# EasyEDA Pro project uChameleon.eprj, schematic Schematic1

## Sheets
1 Pico: Board Name: Board1; Create Date: 2026-08-13; Page Name: Pico; Project Name: uChameleon; Schematic Name: Schematic1; Update Date: 2026-08-26; Company: EasyEDA.com; Page Size: A4; Version: V1.0
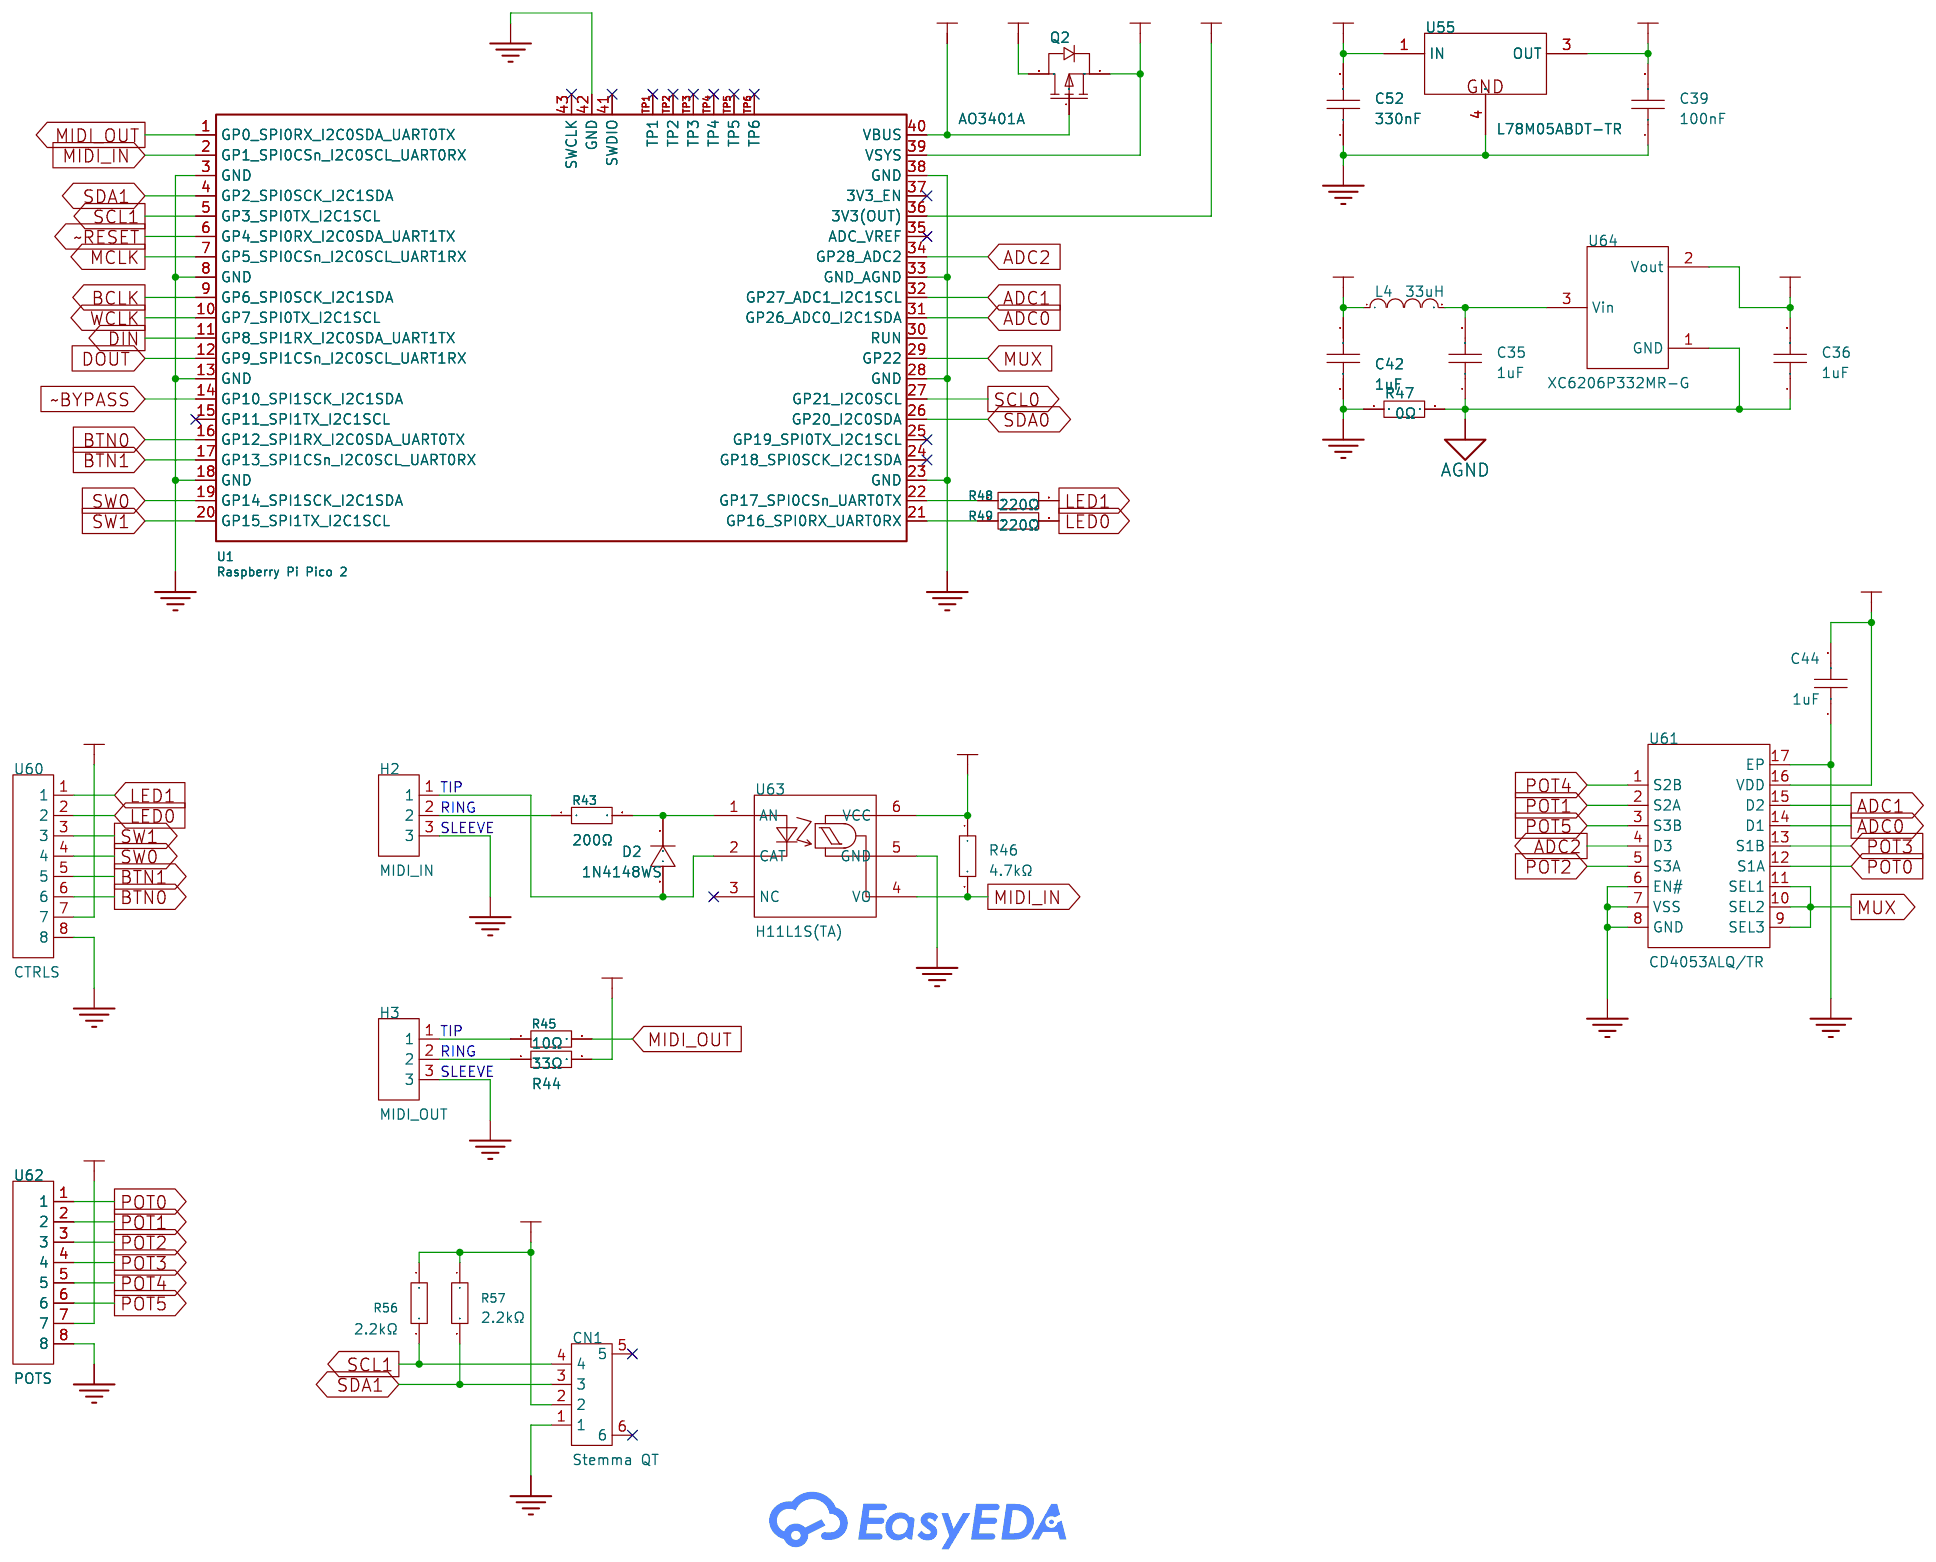
[diagram p0: Pico]
2 Codec: Page Name: Codec
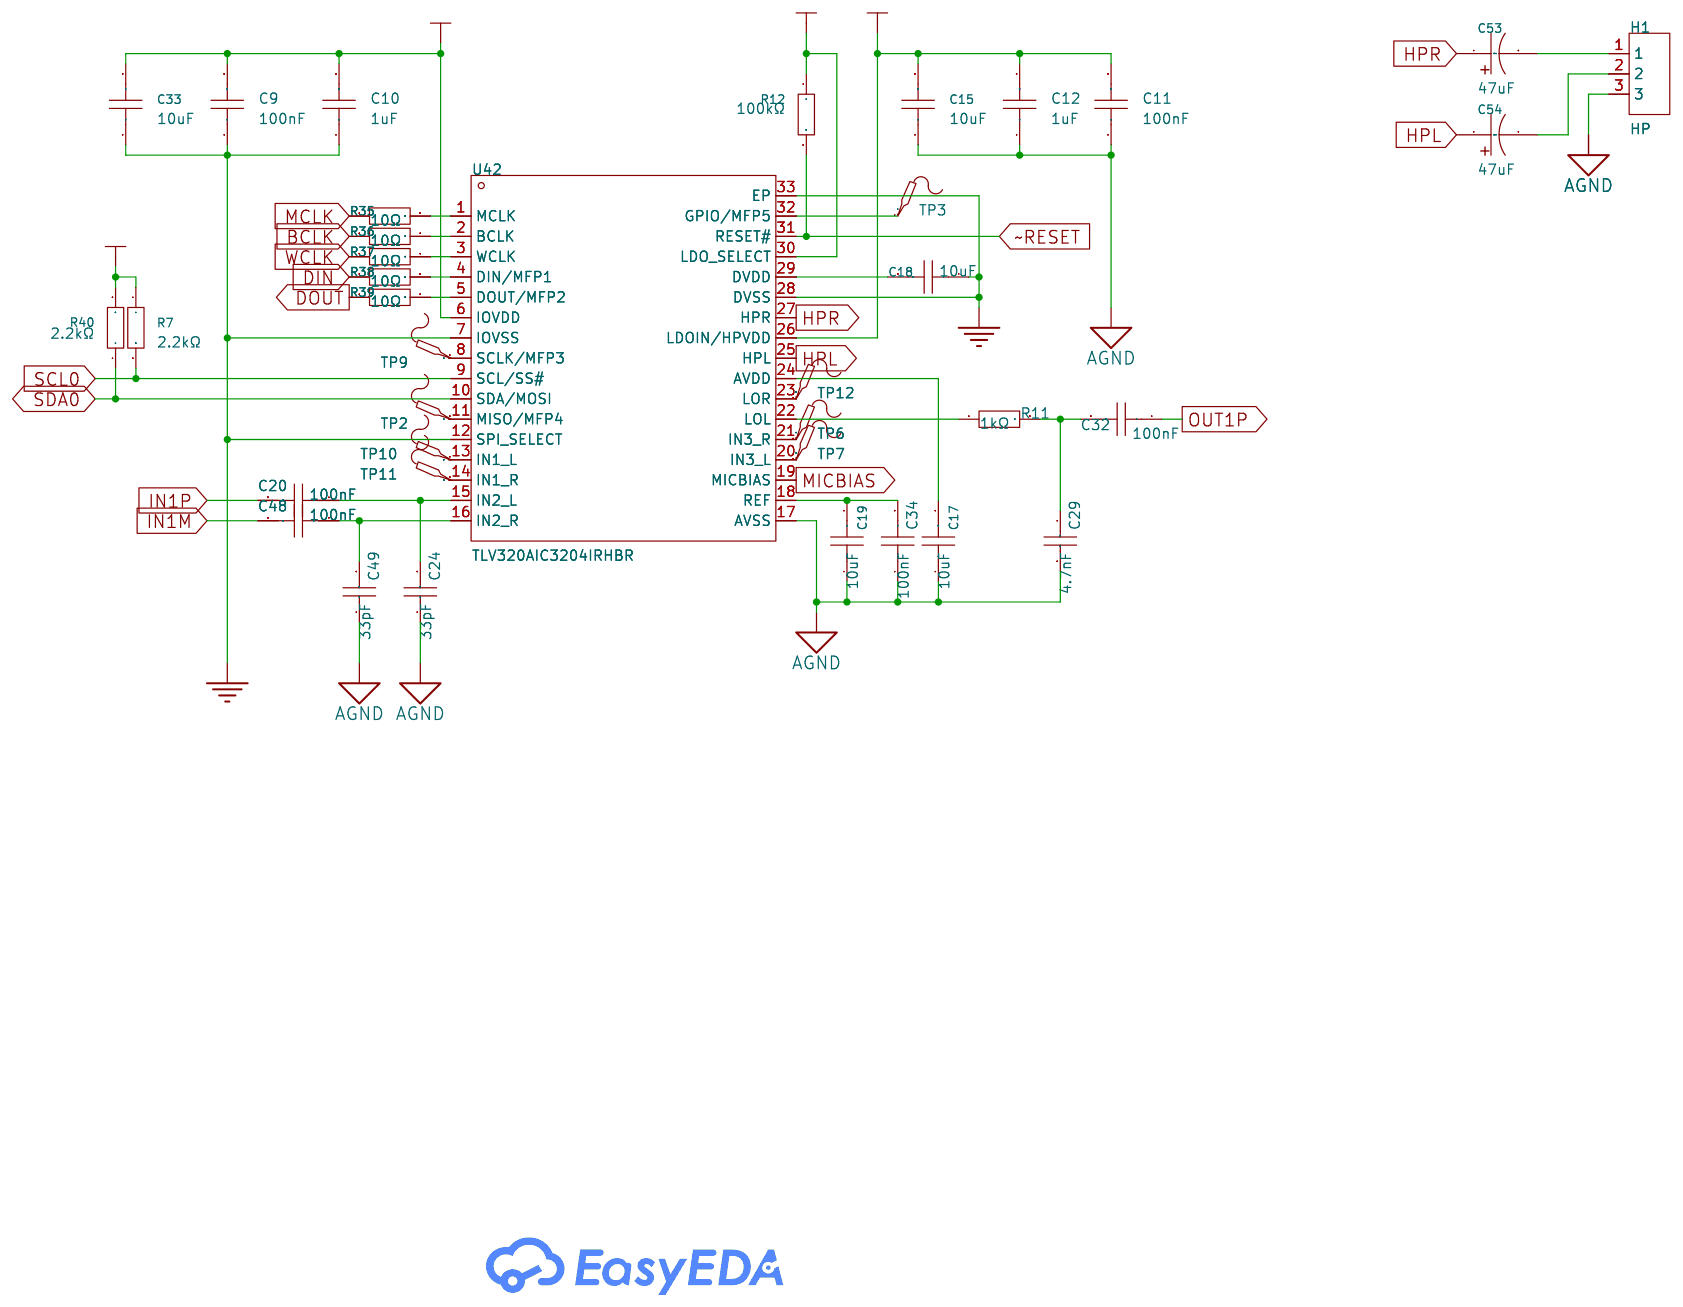
[diagram p1: Codec]
3 Preamp: Page Name: Preamp; Project Name: μChameleon; Update Date: 2026-08-13
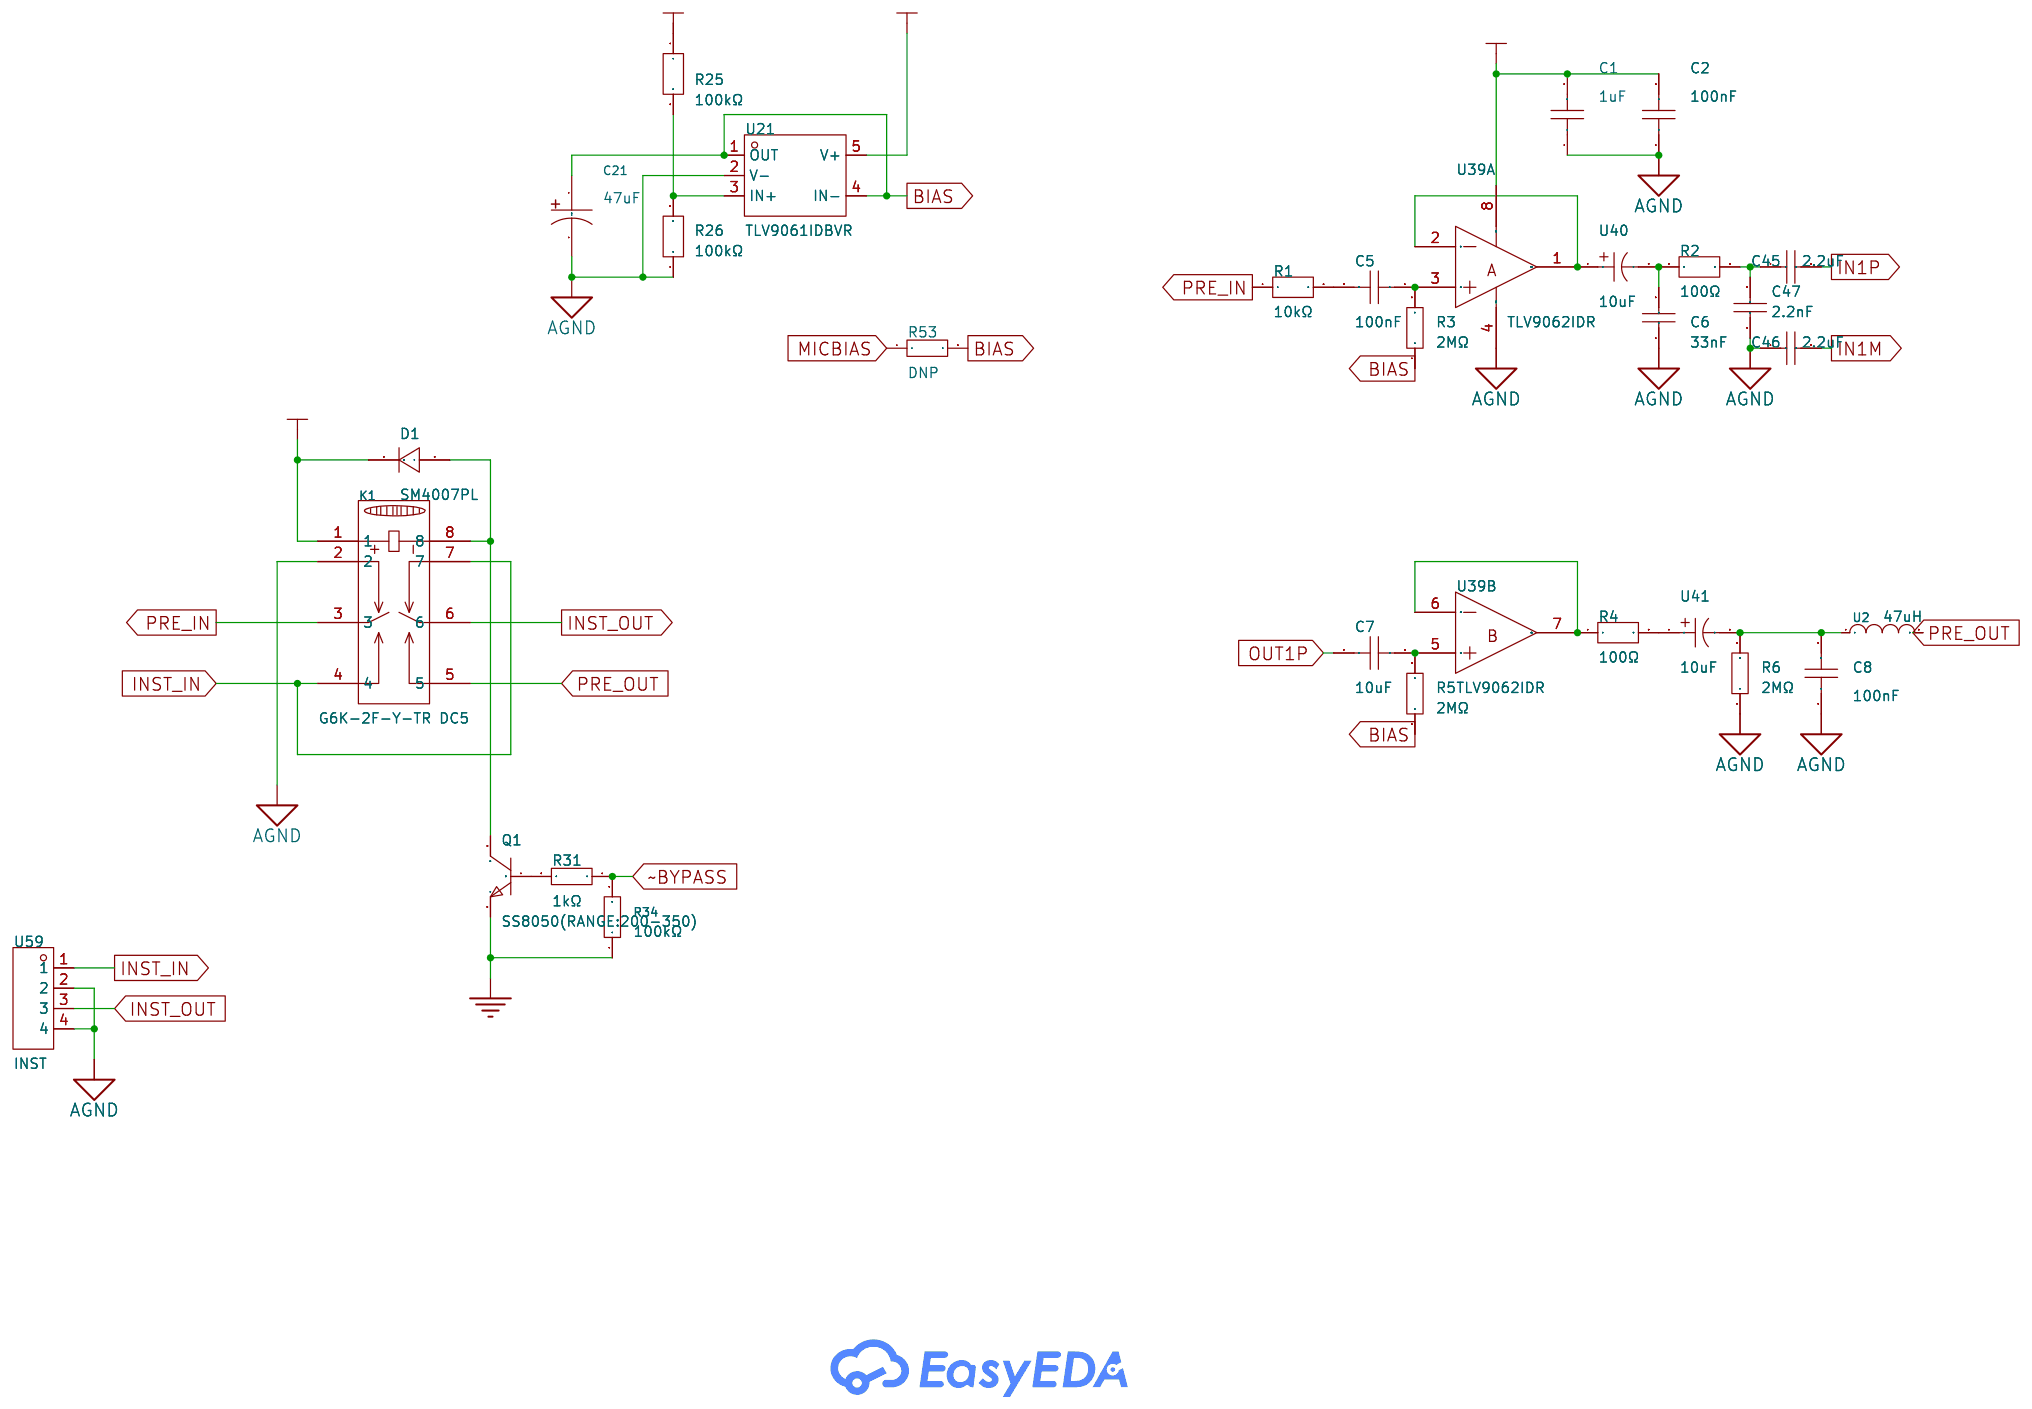
[diagram p2: Preamp]

## Parts
sheet Codec
C9  100nF  [C0603]
C10  1uF  [C0603]
C11  100nF  [C0603]
C12  1uF  [C0603]
C15  10uF  [C0603]
C17  10uF  [C0603]
C18  10uF  [C0603]
C19  10uF  [C0603]
C20  100nF  [C0603]
C24  33pF  [C0402]
C29  4.7nF  [C0402]
C32  100nF  [C0603]
C33  10uF  [C0603]
C34  100nF  [C0603]
C48  100nF  [C0603]
C49  33pF  [C0402]
C53  47uF  [CAP-SMD_BD5.0-L5.3-W5.3-LS6.0-FD]
C54  47uF  [CAP-SMD_BD5.0-L5.3-W5.3-LS6.0-FD]
H1  HP  [HDR-TH_3P-P2.54-V-M]
R7  2.2kΩ  [R0402]
R11  1kΩ  [R0402]
R12  100kΩ  [R0402]
R35  10Ω  [R0402]
R36  10Ω  [R0402]
R37  10Ω  [R0402]
R38  10Ω  [R0402]
R39  10Ω  [R0402]
R40  2.2kΩ  [R0402]
TP2  -  [Test-Point-0.5mm]
TP3  -  [Test-Point-0.5mm]
TP6  -  [Test-Point-0.5mm]
TP7  -  [Test-Point-0.5mm]
TP9  -  [Test-Point-0.5mm]
TP10  -  [Test-Point-0.5mm]
TP11  -  [Test-Point-0.5mm]
TP12  -  [Test-Point-0.5mm]
U42  TLV320AIC3204IRHBR  [QFN-32_L5.0-W5.0-P0.50-TL-EP3.4]
sheet Pico
C35  1uF  [C0603]
C36  1uF  [C0603]
C39  100nF  [C0805]
C42  1uF  [C0603]
C44  1uF  [C0603]
C52  330nF  [C0805]
CN1  Stemma QT  [CONN-SMD_4P-P1.00_XY-SM04B-SRSS-TB]
D2  1N4148WS  [SOD-323_L1.8-W1.3-LS2.5-RD]
H2  MIDI_IN  [HDR-TH_3P-P2.54-V-M]
H3  MIDI_OUT  [HDR-TH_3P-P2.54-V-M]
L4  33uH  [IND-SMD_L3.1-W3.1]
Q2  AO3401A  [SOT-23-3_L2.9-W1.3-P0.95-LS2.4-BR-1]
R43  200Ω  [R0402]
R44  33Ω  [R0603]
R45  10Ω  [R0603]
R46  4.7kΩ  [R0603]
R47  0Ω  [R0603]
R48  220Ω  [R0402]
R49  220Ω  [R0402]
R56  2.2kΩ  [R0402]
R57  2.2kΩ  [R0402]
U1  Raspberry Pi Pico 2  [COMM-SMD_L51.0-W21.0-P2.54_SC0916]
U55  L78M05ABDT-TR  [TO-252-2_L6.5-W6.1-P4.58-LS10.0-TL]
U60  CTRLS  [CONN-TH_8P-P3.50_DORABO_DB125-3.5-8P-GN-S]
U61  CD4053ALQ/TR  [QFN-16_L3.0-W3.0-P0.50-TL-EP1.7-A]
U62  POTS  [CONN-TH_8P-P3.50_DORABO_DB125-3.5-8P-GN-S]
U63  H11L1S(TA)  [SMD-6_L7.3-W6.5-P2.54-LS10.2-BL]
U64  XC6206P332MR-G  [SOT-23-3_L2.9-W1.6-P1.90-LS2.8-BR]
sheet Preamp
C1  1uF  [C0603]
C2  100nF  [C0402]
C5  100nF  [C0402]
C6  33nF  [C0603]
C7  10uF  [C0603]
C8  100nF  [C0402]
C21  47uF  [CAP-SMD_BD5.0-L5.3-W5.3-LS6.0-FD]
C45  2.2uF  [C0603]
C46  2.2uF  [C0603]
C47  2.2nF  [C0603]
D1  SM4007PL  [SOD-123F_L2.8-W1.8-LS3.7-RD]
K1  G6K-2F-Y-TR DC5  [RELAY-SMD_G6K-2F-X-XX]
Q1  SS8050(RANGE:200-350)  [SOT-23-3_L3.0-W1.3-P1.90-LS2.5-BR]
R1  10kΩ  [R0603]
R2  100Ω  [R0603]
R3  2MΩ  [R0603]
R4  100Ω  [R0603]
R5  2MΩ  [R0603]
R6  2MΩ  [R0603]
R25  100kΩ  [R0402]
R26  100kΩ  [R0402]
R31  1kΩ  [R0402]
R34  100kΩ  [R0402]
R53  DNP  [R0402]
U2  47uH  [IND-SMD_L3.0-W3.0-HPC3015TF-2R2M]
U21  TLV9061IDBVR  [SOT-23-5_L3.0-W1.7-P0.95-LS2.8-BL]
U39  TLV9062IDR  [SOIC-8_L5.0-W4.0-P1.27-LS6.0-BL]  (sections 1,2)
U40  10uF  [CAP-SMD_BD4.0-L4.3-W4.3-LS5.0-FD]
U41  10uF  [CAP-SMD_BD4.0-L4.3-W4.3-LS5.0-FD]
U59  INST  [CONN-TH_DB125-3.5-4P-GN]

## Library data of the parts
C9 C11 C20 C32 C34 C48 = CC0603KRX7R9BB104: Capacitance:100nF Tolerance:±10% Tolerance:±10% Voltage Rating:50V Temperature Coefficient:X7R; LCSC Part Name: 100nF ±10% 50V; Supplier Part: C14663; Manufacturer: YAGEO(国巨); Supplier Footprint: 0603; JLCPCB Part Class: Basic Part; Datasheet: https://item.szlcsc.com/datasheet/CC0603KRX7R9BB104/15331.html; Supplier: LCSC; Tolerance: ±10%; Voltage Rating: 50V; Temperature Coefficient: X7R
C1 C10 C12 C35 C36 C42 C44 = CL10A105KB8NNNC: Capacitance:1uF Tolerance:±10% Tolerance:±10% Voltage Rating:50V Temperature Coefficient:X5R; LCSC Part Name: 1uF ±10% 50V; Supplier Part: C15849; Manufacturer: SAMSUNG(三星); Supplier Footprint: 0603; JLCPCB Part Class: Basic Part; Datasheet: https://item.szlcsc.com/datasheet/CL10A105KB8NNNC/16531.html; Supplier: LCSC; Tolerance: ±10%; Voltage Rating: 50V; Temperature Coefficient: X5R
C7 C15 C17-C19 C33 = CL10A106MA8NRNC: Capacitance:10uF Tolerance:±20% Tolerance:±20% Voltage Rating:25V Temperature Coefficient:X5R; LCSC Part Name: 10uF ±20% 25V; Supplier Part: C96446; Manufacturer: SAMSUNG(三星); Supplier Footprint: 0603; JLCPCB Part Class: Basic Part; Datasheet: https://item.szlcsc.com/datasheet/CL10A106MA8NRNC/97651.html; Supplier: LCSC; Tolerance: ±20%; Voltage Rating: 25V; Temperature Coefficient: X5R
C24 C49 = 0402CG330J500NT: Capacitance:33pF Tolerance:±5% Tolerance:±5% Voltage Rating:50V Temperature Coefficient:C0G; LCSC Part Name: 33pF ±5% 50V; Supplier Part: C1562; Manufacturer: FH(风华); Supplier Footprint: 0402; JLCPCB Part Class: Basic Part; Datasheet: https://item.szlcsc.com/datasheet/0402CG330J500NT/1914.html; Supplier: LCSC; Tolerance: ±5%; Voltage Rating: 50V; Temperature Coefficient: C0G
C29 = 0402B472K500NT: Capacitance:4.7nF Tolerance:±10% Tolerance:±10% Voltage Rating:50V Temperature Coefficient:X7R; LCSC Part Name: 4.7nF ±10% 50V; Supplier Part: C1538; Manufacturer: FH(风华); Supplier Footprint: 0402; JLCPCB Part Class: Basic Part; Datasheet: https://item.szlcsc.com/datasheet/0402B472K500NT/1890.html; Supplier: LCSC; Tolerance: ±10%; Voltage Rating: 50V; Temperature Coefficient: X7R
C21 C53 C54 = EFVH025ADA470M0554: Capacitance:47uF Tolerance:±20% Tolerance:±20% Voltage Rating:25V Diameter:5mm Height - Seated (Max):5.4mm Operating Temperature:-55℃~+105℃ Operating Temperature:-55℃~+105℃; LCSC Part Name: 47uF ±20% 25V; Supplier Part: C22387973; Manufacturer: FOLLON(富隆电子); Supplier Footprint: SMD,D5xL5.4mm; JLCPCB Part Class: Extended Part; Datasheet: https://item.szlcsc.com/datasheet/EFVH025ADA470M0554/23952431.html; Supplier: LCSC; Tolerance: ±20%; Voltage Rating: 25V; Diameter: 5mm; Height - Seated (Max): 5.4mm; Operating Temperature: -55℃~+105℃
H1-H3 = HDR-M_2.54_1x3P: Supplier Footprint: Through; Standardization Check: false
R7 R40 R56 R57 = 0402WGF2201TCE: Type:Thick Film Resistor Resistance:2.2kΩ Tolerance:±1% Tolerance:±1% Power(Watts):62.5mW Voltage-Supply(Max):50V Temperature Coefficient:±100ppm/℃ Temperature Coefficient:±100ppm/℃ Operating Temperature:-55℃~+155℃ Operating Temperature:-55℃~+155℃; LCSC Part Name: 2.2kΩ ±1% 62.5mW 厚膜电阻; Supplier Part: C25879; Manufacturer: UNI-ROYAL(厚声); Supplier Footprint: 0402; JLCPCB Part Class: Basic Part; Datasheet: https://item.szlcsc.com/datasheet/0402WGF2201TCE/26622.html; Supplier: LCSC; Type: Thick Film Resistor; Tolerance: ±1%; Power(Watts): 62.5mW; Voltage-Supply(Max): 50V; Temperature Coefficient: ±100ppm/℃; Operating Temperature: -55℃~+155℃
R11 R31 = 0402WGF1001TCE: Type:Thick Film Resistor Resistance:1kΩ Tolerance:±1% Tolerance:±1% Power(Watts):62.5mW Voltage-Supply(Max):50V Temperature Coefficient:±100ppm/℃ Temperature Coefficient:±100ppm/℃ Operating Temperature:-55℃~+155℃ Operating Temperature:-55℃~+155℃; LCSC Part Name: 1kΩ ±1% 62.5mW 厚膜电阻; Supplier Part: C11702; Manufacturer: UNI-ROYAL(厚声); Supplier Footprint: 0402; JLCPCB Part Class: Basic Part; Datasheet: https://item.szlcsc.com/datasheet/0402WGF1001TCE/12256.html; Supplier: LCSC; Type: Thick Film Resistor; Tolerance: ±1%; Power(Watts): 62.5mW; Voltage-Supply(Max): 50V; Temperature Coefficient: ±100ppm/℃; Operating Temperature: -55℃~+155℃
R12 R25 R26 R34 = 0402WGF1003TCE: Type:Thick Film Resistor Resistance:100kΩ Tolerance:±1% Tolerance:±1% Power(Watts):62.5mW Voltage-Supply(Max):50V Temperature Coefficient:±100ppm/℃ Temperature Coefficient:±100ppm/℃ Operating Temperature:-55℃~+155℃ Operating Temperature:-55℃~+155℃; LCSC Part Name: 100kΩ ±1% 62.5mW 厚膜电阻; Supplier Part: C25741; Manufacturer: UNI-ROYAL(厚声); Supplier Footprint: 0402; JLCPCB Part Class: Basic Part; Datasheet: https://item.szlcsc.com/datasheet/0402WGF1003TCE/26484.html; Supplier: LCSC; Type: Thick Film Resistor; Tolerance: ±1%; Power(Watts): 62.5mW; Voltage-Supply(Max): 50V; Temperature Coefficient: ±100ppm/℃; Operating Temperature: -55℃~+155℃
R35-R39 = 0402WGF100JTCE: Type:Thick Film Resistor Resistance:10Ω Tolerance:±1% Tolerance:±1% Power(Watts):62.5mW Voltage-Supply(Max):50V Temperature Coefficient:±200ppm/℃ Temperature Coefficient:±200ppm/℃ Operating Temperature:-55℃~+155℃ Operating Temperature:-55℃~+155℃; LCSC Part Name: 10Ω ±1% 62.5mW 厚膜电阻; Supplier Part: C25077; Manufacturer: UNI-ROYAL(厚声); Supplier Footprint: 0402; JLCPCB Part Class: Basic Part; Datasheet: https://item.szlcsc.com/datasheet/0402WGF100JTCE/25820.html; Supplier: LCSC; Type: Thick Film Resistor; Tolerance: ±1%; Power(Watts): 62.5mW; Voltage-Supply(Max): 50V; Temperature Coefficient: ±200ppm/℃; Operating Temperature: -55℃~+155℃
TP2 TP3 TP6 TP7 TP9-TP12 = Test-Point: Test Point 测试点; Standardization Check: false
U42 = TLV320AIC3204IRHBR: Type:Encoder/decoder Interface:I2C；SPI Sampling Rate:8kHz~192kHz Sampling Rate:8kHz~192kHz Voltage - Supply:1.5V~1.95V；1.26V~1.95V；1.1V~3.6V Voltage - Supply:1.5V~1.95V；1.26V~1.95V；1.1V~3.6V Operating Temperature:-40℃~+85℃ Operating Temperature:-40℃~+85℃; LCSC Part Name: 超低功耗立体声音频编解码器; Supplier Part: C24109; Manufacturer: TI(德州仪器); Supplier Footprint: QFN-32-EP(5x5); JLCPCB Part Class: Extended Part; Datasheet: https://www.ti.com/cn/lit/gpn/tlv320aic3204; Supplier: LCSC; Type: Encoder/decoder; Interface: I2C；SPI; Sampling Rate: 8kHz~192kHz; Voltage - Supply: 1.5V~1.95V；1.26V~1.95V；1.1V~3.6V; Operating Temperature: -40℃~+85℃
C39 = CC0805KRX7R9BB104: Capacitance:100nF Tolerance:±10% Tolerance:±10% Voltage Rating:50V Temperature Coefficient:X7R; LCSC Part Name: 100nF ±10% 50V; Supplier Part: C49678; Manufacturer: YAGEO(国巨); Supplier Footprint: 0805; JLCPCB Part Class: Basic Part; Datasheet: https://item.szlcsc.com/datasheet/CC0805KRX7R9BB104/50686.html; Supplier: LCSC; Tolerance: ±10%; Voltage Rating: 50V; Temperature Coefficient: X7R
C52 = 08053C334K4Z2A: Capacitance:330nF Tolerance:±10% Tolerance:±10% Voltage Rating:25V Temperature Coefficient:X7R; LCSC Part Name: 330nF ±10% 25V; Supplier Part: C273671; Manufacturer: Kyocera AVX; Supplier Footprint: 0805; JLCPCB Part Class: Extended Part; Supplier: LCSC; Tolerance: ±10%; Voltage Rating: 25V; Temperature Coefficient: X7R
CN1 = XY-SM04B-SRSS-TB: Pins Structure:1x4P Pitch:1mm Mounting Type:Surface Mount, Right Angle Number of Pins:4P Number of Rows:1 Number of PINs Per Row:4 Current Rating:1A Contact Material:Brass Contact Plating:Tin Operating Temperature:-25℃~+85℃ Operating Temperature:-25℃~+85℃; LCSC Part Name: 1x4P 间距:1mm 卧贴; Supplier Part: C51940130; Manufacturer: XYECONN(辛译); Supplier Footprint: SMD,P=1mm,卧贴; JLCPCB Part Class: Extended Part; Datasheet: https://item.szlcsc.com/datasheet/XY-SM04B-SRSS-TB/54660512.html; Supplier: LCSC; Pins Structure: 1x4P; Pitch: 1mm; Mounting Type: Surface Mount, Right Angle; Number of Pins: 4P; Number of Rows: 1; Number of PINs Per Row: 4; Current Rating: 1A; Contact Material: Brass; Contact Plating: Tin; Operating Temperature: -25℃~+85℃; Voltage Rating: 50V; Plastic Material: LCP; Flame Retardant Rating: UL94V-0
D2 = 1N4148WS_C2128: Diode Configuration:Standalone Pd - Power Dissipation:200mW Current - Rectified:150mA Voltage - DC Reverse(Vr):100V Voltage - Forward(Vf@If):1.25V@150mA Non-Repetitive Peak Forward Surge Current:2A Reverse Leakage Current (Ir):1uA@75V Reverse Recovery Tim; LCSC Part Name: 丝印T4 100V 150mA; Supplier Part: C2128; Manufacturer: CJ(江苏长电/长晶); Supplier Footprint: SOD-323; JLCPCB Part Class: Basic Part; Datasheet: https://item.szlcsc.com/datasheet/1N4148WS/2485.html; Supplier: LCSC; Diode Configuration: Standalone; Pd - Power Dissipation: 200mW; Current - Rectified: 150mA; Voltage - DC Reverse(Vr): 100V; Voltage - Forward(Vf@If): 1.25V@150mA; Non-Repetitive Peak Forward Surge Current: 2A; Reverse Leakage Current (Ir): 1uA@75V; Reverse Recovery Time (trr): 4ns
L4 = SQH3010S-330M-LF: Inductance:33uH Tolerance:±20% Tolerance:±20% Current Rating:275mA Current - Saturation(Isat):260mA DC Resistance(DCR):2.015Ω; LCSC Part Name: 33uH ±20%; Supplier Part: C257160; Manufacturer: Coilmaster(统宇电研); Supplier Footprint: SMD,3.1x3.1mm; JLCPCB Part Class: Extended Part; Datasheet: https://item.szlcsc.com/datasheet/SQH3010S-330M-LF/250581.html; Supplier: LCSC; Tolerance: ±20%; Current Rating: 275mA; Current - Saturation(Isat): 260mA; DC Resistance(DCR): 2.015Ω
Q2 = AO3401A_C15127: Number:1 P-Channel Drain to Source Voltage:30V Current - Continuous Drain(Id):4A RDS(on):47mΩ@10V；85mΩ@2.5V；60mΩ@4.5V Pd - Power Dissipation:- Gate Threshold Voltage (Vgs(th)):900mV Gate Charge(Qg):14nC@10V Input Capacitance(Ciss):645pF Reverse Transfer C; LCSC Part Name: 1个P沟道 耐压:30V 电流:4A; Supplier Part: C15127; Manufacturer: AOS; Supplier Footprint: SOT-23; JLCPCB Part Class: Basic Part; Datasheet: https://item.szlcsc.com/datasheet/AO3401A/15801.html; Supplier: LCSC; Number: 1 P-Channel; Drain to Source Voltage: 30V; Current - Continuous Drain(Id): 4A; RDS(on): 47mΩ@10V；85mΩ@2.5V；60mΩ@4.5V; Gate Threshold Voltage (Vgs(th)): 900mV; Gate Charge(Qg): 14nC@10V; Input Capacitance(Ciss): 645pF; Reverse Transfer Capacitance (Crss@Vds): 55pF; Output Capacitance(Coss): 80pF
R43 = 0402WGF2000TCE: Type:Thick Film Resistor Resistance:200Ω Tolerance:±1% Tolerance:±1% Power(Watts):62.5mW Voltage-Supply(Max):50V Temperature Coefficient:±100ppm/℃ Temperature Coefficient:±100ppm/℃ Operating Temperature:-55℃~+155℃ Operating Temperature:-55℃~+155℃; LCSC Part Name: 200Ω ±1% 62.5mW 厚膜电阻; Supplier Part: C25087; Manufacturer: UNI-ROYAL(厚声); Supplier Footprint: 0402; JLCPCB Part Class: Basic Part; Datasheet: https://item.szlcsc.com/datasheet/0402WGF2000TCE/25830.html; Supplier: LCSC; Type: Thick Film Resistor; Tolerance: ±1%; Power(Watts): 62.5mW; Voltage-Supply(Max): 50V; Temperature Coefficient: ±100ppm/℃; Operating Temperature: -55℃~+155℃
R44 = 0603WAF330JT5E: Type:Thick Film Resistor Resistance:33Ω Tolerance:±1% Tolerance:±1% Power(Watts):100mW Voltage-Supply(Max):75V Temperature Coefficient:±100ppm/℃ Temperature Coefficient:±100ppm/℃ Operating Temperature:-55℃~+155℃ Operating Temperature:-55℃~+155℃; LCSC Part Name: 33Ω ±1% 100mW 厚膜电阻; Supplier Part: C23140; Manufacturer: UNI-ROYAL(厚声); Supplier Footprint: 0603; JLCPCB Part Class: Basic Part; Datasheet: https://item.szlcsc.com/datasheet/0603WAF330JT5E/23867.html; Supplier: LCSC; Type: Thick Film Resistor; Tolerance: ±1%; Power(Watts): 100mW; Voltage-Supply(Max): 75V; Temperature Coefficient: ±100ppm/℃; Operating Temperature: -55℃~+155℃
R45 = 0603WAF100JT5E: Type:Thick Film Resistor Resistance:10Ω Tolerance:±1% Tolerance:±1% Power(Watts):100mW Voltage-Supply(Max):75V Temperature Coefficient:±400ppm/℃ Temperature Coefficient:±400ppm/℃ Operating Temperature:-55℃~+155℃ Operating Temperature:-55℃~+155℃; LCSC Part Name: 10Ω ±1% 100mW 厚膜电阻; Supplier Part: C22859; Manufacturer: UNI-ROYAL(厚声); Supplier Footprint: 0603; JLCPCB Part Class: Basic Part; Datasheet: https://item.szlcsc.com/datasheet/0603WAF100JT5E/23586.html; Supplier: LCSC; Type: Thick Film Resistor; Tolerance: ±1%; Power(Watts): 100mW; Voltage-Supply(Max): 75V; Temperature Coefficient: ±400ppm/℃; Operating Temperature: -55℃~+155℃
R46 = 0603WAF4701T5E: Type:Thick Film Resistor Resistance:4.7kΩ Tolerance:±1% Tolerance:±1% Power(Watts):100mW Voltage-Supply(Max):75V Temperature Coefficient:±100ppm/℃ Temperature Coefficient:±100ppm/℃ Operating Temperature:-55℃~+155℃ Operating Temperature:-55℃~+155℃; LCSC Part Name: 4.7kΩ ±1% 100mW 厚膜电阻; Supplier Part: C23162; Manufacturer: UNI-ROYAL(厚声); Supplier Footprint: 0603; Datasheet: https://item.szlcsc.com/datasheet/0603WAF4701T5E/23889.html; Supplier: LCSC; Type: Thick Film Resistor; Tolerance: ±1%; Power(Watts): 100mW; Voltage-Supply(Max): 75V; Temperature Coefficient: ±100ppm/℃; Operating Temperature: -55℃~+155℃
R47 = 0603WAF0000T5E: Type:Thick Film Resistor Resistance:0Ω Tolerance:±1% Tolerance:±1% Power(Watts):100mW Voltage-Supply(Max):75V Temperature Coefficient:- Temperature Coefficient:- Operating Temperature:-55℃~+155℃ Operating Temperature:-55℃~+155℃; LCSC Part Name: 0Ω ±1% 100mW 厚膜电阻; Supplier Part: C21189; Manufacturer: UNI-ROYAL(厚声); Supplier Footprint: 0603; JLCPCB Part Class: Basic Part; Datasheet: https://item.szlcsc.com/datasheet/0603WAF0000T5E/21903.html; Supplier: LCSC; Type: Thick Film Resistor; Tolerance: ±1%; Power(Watts): 100mW; Voltage-Supply(Max): 75V; Operating Temperature: -55℃~+155℃
R48 R49 = 0402WGF2200TCE: Type:Thick Film Resistor Resistance:220Ω Tolerance:±1% Tolerance:±1% Power(Watts):62.5mW Voltage-Supply(Max):50V Temperature Coefficient:±100ppm/℃ Temperature Coefficient:±100ppm/℃ Operating Temperature:-55℃~+155℃ Operating Temperature:-55℃~+155℃; LCSC Part Name: 220Ω ±1% 62.5mW 厚膜电阻; Supplier Part: C25091; Manufacturer: UNI-ROYAL(厚声); Supplier Footprint: 0402; JLCPCB Part Class: Basic Part; Datasheet: https://item.szlcsc.com/datasheet/0402WGF2200TCE/25834.html; Supplier: LCSC; Type: Thick Film Resistor; Tolerance: ±1%; Power(Watts): 62.5mW; Voltage-Supply(Max): 50V; Temperature Coefficient: ±100ppm/℃; Operating Temperature: -55℃~+155℃
U1 = Raspberry Pi Pico 2: LCSC Part Name: SC1631; Supplier Part: C41407547; Manufacturer: Raspberry Pi(树莓派); JLCPCB Part Class: Extended Part; Datasheet: https://item.szlcsc.com/datasheet/Raspberry%2520Pi%2520Pico%25202/43207606.html; Supplier: LCSC
U55 = L78M05ABDT-TR: Output Configuration:Positive Voltage - Supply:35V Output Voltage:5V Output Voltage:5V Output Current:500mA Power Supply Rejection Ratio (PSRR):62dB@(120Hz) Voltage Dropout:2V@(350mA) standby current:6mA Noise:40uV Features:Thermal shutdown；Short Circuit; LCSC Part Name: 5V 500mA 35V; Supplier Part: C58069; Manufacturer: ST(意法半导体); Supplier Footprint: TO-252-2(DPAK); JLCPCB Part Class: Basic Part; Datasheet: https://item.szlcsc.com/datasheet/L78M05ABDT-TR/59107.html; Supplier: LCSC; Output Configuration: Positive; Voltage - Supply: 35V; Output Voltage: 5V; Output Current: 500mA; Power Supply Rejection Ratio (PSRR): 62dB@(120Hz); Voltage Dropout: 2V@(350mA); standby current: 6mA; Noise: 40uV; Features: Thermal shutdown；Short Circuit Protection; Operating Temperature: -40℃~+125℃@(Tj); Output Type: Fixed; Number of Outputs: 1
U60 U62 = DB125-3.5-8P-GN-S: Number of Positions or Pins:1x8P Pitch:3.5mm Color:Green Mounting Type:Through Hole Number of Pins:8P Number of Rows:1 Number of PINs Per Row:8 Screw Specification:M2 Current Rating:10A Voltage Rating (Max):300V Wire Gauge - AWG:16~28 Wire Gauge - AWG:16~; LCSC Part Name: 1x8P 3.5mm 直插 排数:1 每排P数:8; Supplier Part: C5184954; Manufacturer: DORABO(地博电气); Supplier Footprint: 插件,P=3.5mm; JLCPCB Part Class: Extended Part; Datasheet: https://item.szlcsc.com/datasheet/DB125-3.5-8P-GN-S/5851538.html; Supplier: LCSC; Number of Positions or Pins: 1x8P; Pitch: 3.5mm; Color: Green; Mounting Type: Through Hole; Number of Pins: 8P; Number of Rows: 1; Number of PINs Per Row: 8; Screw Specification: M2; Current Rating: 10A; Voltage Rating (Max): 300V; Wire Gauge - AWG: 16~28; Wire Gauge - mm2: 1; Operating Temperature: -40℃~+105℃
U61 = CD4053ALQ/TR: Switch Circuit:2:1 Number of Channels:3 Voltage - Supply:3V~15V Voltage - Supply:3V~15V Ron:1.05kΩ@5V Operating Temperature:-40℃~+85℃ Operating Temperature:-40℃~+85℃ Con:0.2pF Propagation Delay (tpd):25ns; LCSC Part Name: 三路二选一模拟开关; Supplier Part: C50703794; Manufacturer: HGSEMI(华冠); Supplier Footprint: QFN-16(3x3); JLCPCB Part Class: Extended Part; Datasheet: https://item.szlcsc.com/datasheet/CD4053ALQ%252FTR/53338590.html; Supplier: LCSC; Switch Circuit: 2:1; Number of Channels: 3; Voltage - Supply: 3V~15V; Ron: 1.05kΩ@5V; Operating Temperature: -40℃~+85℃; Con: 0.2pF; Propagation Delay (tpd): 25ns
U63 = H11L1S(TA): Input Type:DC Voltage - Supply:3V~15V Voltage - Supply:3V~15V Isolation Voltage(Vrms):5kV Data Rate:1Mbit/s Number of Channels:1 Operating Temperature:-55℃~+100℃ Operating Temperature:-55℃~+100℃ Low level Delay Time:- High level Delay Time:- Input thresho; LCSC Part Name: DC输入 1通道 隔离电压(rms):5000V; Supplier Part: C78589; Manufacturer: EVERLIGHT(亿光); Supplier Footprint: SOP-6-2.54mm; JLCPCB Part Class: Extended Part; Datasheet: https://www.everlighteurope.com/custom/files/datasheets/DPC-0000022.pdf; Supplier: LCSC; Input Type: DC; Voltage - Supply: 3V~15V; Isolation Voltage(Vrms): 5kV; Data Rate: 1Mbit/s; Number of Channels: 1; Operating Temperature: -55℃~+100℃; Input threshold current: 1.6mA; power dissipation: 250mW
U64 = XC6206P332MR-G_C5446: Output Configuration:Positive Voltage - Supply:6V Output Voltage:3.3V Output Voltage:3.3V Output Current:200mA Power Supply Rejection Ratio (PSRR):- Voltage Dropout:- standby current:1uA Noise:- Features:Short Circuit Protection；Over Current Protection Op; LCSC Part Name: 3.3V 200mA 6V; Supplier Part: C5446; Manufacturer: TOREX(特瑞仕); Supplier Footprint: SOT-23-3L; Datasheet: https://item.szlcsc.com/datasheet/XC6206P332MR-G/5896.html; Supplier: LCSC; Output Configuration: Positive; Voltage - Supply: 6V; Output Voltage: 3.3V; Output Current: 200mA; standby current: 1uA; Features: Short Circuit Protection；Over Current Protection; Operating Temperature: -40℃~+85℃@(Ta); Output Type: Fixed; Number of Outputs: 1
C2 C5 C8 = CL05B104KO5NNNC: Capacitance:100nF Tolerance:±10% Tolerance:±10% Voltage Rating:16V Temperature Coefficient:X7R; LCSC Part Name: 100nF ±10% 16V; Supplier Part: C1525; Manufacturer: SAMSUNG(三星); Supplier Footprint: 0402; JLCPCB Part Class: Basic Part; Datasheet: https://item.szlcsc.com/datasheet/CL05B104KO5NNNC/1877.html; Supplier: LCSC; Tolerance: ±10%; Voltage Rating: 16V; Temperature Coefficient: X7R
C6 = CL10B333KB8NNNC: Capacitance:33nF Tolerance:±10% Tolerance:±10% Voltage Rating:50V Temperature Coefficient:X7R; LCSC Part Name: 33nF ±10% 50V; Supplier Part: C21117; Manufacturer: SAMSUNG(三星); Supplier Footprint: 0603; JLCPCB Part Class: Basic Part; Datasheet: https://item.szlcsc.com/datasheet/CL10B333KB8NNNC/21829.html; Supplier: LCSC; Tolerance: ±10%; Voltage Rating: 50V; Temperature Coefficient: X7R
C45 C46 = CL10A225KO8NNNC: Capacitance:2.2uF Tolerance:±10% Tolerance:±10% Voltage Rating:16V Temperature Coefficient:X5R; LCSC Part Name: 2.2uF ±10% 16V; Supplier Part: C23630; Manufacturer: SAMSUNG(三星); Supplier Footprint: 0603; JLCPCB Part Class: Basic Part; Datasheet: https://item.szlcsc.com/datasheet/CL10A225KO8NNNC/24366.html; Supplier: LCSC; Tolerance: ±10%; Voltage Rating: 16V; Temperature Coefficient: X5R
C47 = 0603B222K500NT: Capacitance:2.2nF Tolerance:±10% Tolerance:±10% Voltage Rating:50V Temperature Coefficient:X7R; LCSC Part Name: 2.2nF ±10% 50V; Supplier Part: C1604; Manufacturer: FH(风华); Supplier Footprint: 0603; JLCPCB Part Class: Basic Part; Datasheet: https://item.szlcsc.com/datasheet/0603B222K500NT/1956.html; Supplier: LCSC; Tolerance: ±10%; Voltage Rating: 50V; Temperature Coefficient: X7R
D1 = SM4007PL_C64898: Diode Configuration:Independent Voltage - Forward(Vf@If):1.1V@1A Voltage - DC Reverse(Vr):1kV Current - Rectified:1A Reverse Leakage Current (Ir):10uA@1kV Non-Repetitive Peak Forward Surge Current:25A Operating Junction Temperature Range:-55℃~+150℃ Operat; LCSC Part Name: 1kV 1A; Supplier Part: C64898; Manufacturer: MDD(辰达半导体); Supplier Footprint: SOD-123FL; JLCPCB Part Class: Basic Part; Datasheet: https://item.szlcsc.com/datasheet/SM4007PL/65968.html; Supplier: LCSC; Diode Configuration: Independent; Voltage - Forward(Vf@If): 1.1V@1A; Voltage - DC Reverse(Vr): 1kV; Current - Rectified: 1A; Reverse Leakage Current (Ir): 10uA@1kV; Non-Repetitive Peak Forward Surge Current: 25A; Operating Junction Temperature Range: -55℃~+150℃
K1 = G6K-2F-Y-TR DC5: Coil Voltage:5V Contact Form:Two sets of changeover: 2C (DPDT) Number of Pins:- Contact Rating:300mA@125VAC；1A@30VDC Switching Voltage(Max):125V@AC；60V@DC Contact Material:Silver + Gold Plated Coil Rated Power:100mW Coil Resistance:237Ω Switching Current(; LCSC Part Name: 5V 1A 两组转换:2C(双刀双掷转换); Supplier Part: C47190; Manufacturer: OMRON(欧姆龙); Supplier Footprint: SMD,10x6.5mm; JLCPCB Part Class: Extended Part; Datasheet: https://item.szlcsc.com/datasheet/G6K-2F-Y-TR%2520DC5/48195.html; Supplier: LCSC; Coil Voltage: 5V; Contact Form: Two sets of changeover: 2C (DPDT); Contact Rating: 300mA@125VAC；1A@30VDC; Switching Voltage(Max): 125V@AC；60V@DC; Contact Material: Silver + Gold Plated; Coil Rated Power: 100mW; Coil Resistance: 237Ω; Switching Current(Max): 1A; Operate Time: 3ms; Release Time: 3ms; Contact Resistance: 100mΩ; Operating Temperature: -40℃~+70℃; Length: 10mm; Width: 6.5mm; Height: 5.2mm
Q1 = SS8050(RANGE:200-350)_C2150: type:NPN Current - Collector(Ic):1.5A Collector - Emitter Voltage VCEO:25V Pd - Power Dissipation:300mW DC Current Gain:200@800mA,1V DC Current Gain:200@800mA,1V Transition frequency(fT):100MHz Current - Collector Cutoff:100nA Vce Saturation(VCE(sat)):500; LCSC Part Name: hfe=200~350 NPN 电流:1.5A 电压:25V; Supplier Part: C2150; Manufacturer: CJ(江苏长电/长晶); Supplier Footprint: SOT-23; JLCPCB Part Class: Basic Part; Datasheet: https://item.szlcsc.com/datasheet/SS8050(RANGE%253A200-350)/2507.html; Supplier: LCSC; type: NPN; Current - Collector(Ic): 1.5A; Collector - Emitter Voltage VCEO: 25V; Pd - Power Dissipation: 300mW; DC Current Gain: 200@800mA,1V; Transition frequency(fT): 100MHz; Current - Collector Cutoff: 100nA; Vce Saturation(VCE(sat)): 500mV@800mA,80mA; Operating Temperature: -55℃~+150℃; Emitter-Base Voltage(Vebo): 5V; Number: 1 NPN
R1 = 0603WAF1002T5E: Type:Thick Film Resistor Resistance:10kΩ Tolerance:±1% Tolerance:±1% Power(Watts):100mW Voltage-Supply(Max):75V Temperature Coefficient:±100ppm/℃ Temperature Coefficient:±100ppm/℃ Operating Temperature:-55℃~+155℃ Operating Temperature:-55℃~+155℃; LCSC Part Name: 厚膜电阻 10kΩ ±1% 100mW; Supplier Part: C25804; Manufacturer: UNI-ROYAL(厚声); Supplier Footprint: 0603; JLCPCB Part Class: Basic Part; Datasheet: https://item.szlcsc.com/datasheet/0603WAF1002T5E/26547.html; Supplier: LCSC; Type: Thick Film Resistor; Tolerance: ±1%; Power(Watts): 100mW; Voltage-Supply(Max): 75V; Temperature Coefficient: ±100ppm/℃; Operating Temperature: -55℃~+155℃
R2 R4 = 0603WAF1000T5E: Type:Thick Film Resistors Resistance: Tolerance:±1% Tolerance:±1% Power(Watts): Overload Voltage (Max): Temperature Coefficient:±200ppm/℃ Temperature Coefficient:±200ppm/℃ Operating Temperature Range:-55℃~+155℃ Operating Temperature Range:-55℃~+155℃; LCSC Part Name: 100Ω ±1% 100mW 厚膜电阻; Supplier Part: C22775; Manufacturer: UNI-ROYAL(厚声); Supplier Footprint: 0603; JLCPCB Part Class: Basic Part; Datasheet: https://atta.szlcsc.com/upload/public/pdf/source/20200306/C422600_1E6D84923E4A46A82E41ADD87F860B5C.pdf; Supplier: LCSC; Type: Thick Film Resistors; Tolerance: ±1%; Temperature Coefficient: ±200ppm/℃; Operating Temperature Range: -55℃~+155℃; Voltage-Supply(Max): 75V; Operating Temperature: -55℃~+155℃
R3 R5 R6 = 0603WAF2004T5E: Type:Thick Film Resistor Resistance:2MΩ Tolerance:±1% Tolerance:±1% Power(Watts):100mW Voltage-Supply(Max):75V Temperature Coefficient:±100ppm/℃ Temperature Coefficient:±100ppm/℃ Operating Temperature:-55℃~+155℃ Operating Temperature:-55℃~+155℃; LCSC Part Name: 2MΩ ±1% 100mW 厚膜电阻; Supplier Part: C22976; Manufacturer: UNI-ROYAL(厚声); Supplier Footprint: 0603; JLCPCB Part Class: Basic Part; Datasheet: https://item.szlcsc.com/datasheet/0603WAF2004T5E/23703.html; Supplier: LCSC; Type: Thick Film Resistor; Tolerance: ±1%; Power(Watts): 100mW; Voltage-Supply(Max): 75V; Temperature Coefficient: ±100ppm/℃; Operating Temperature: -55℃~+155℃
R53 = Res_0402: Supplier Footprint: 0402
U2 = SNR3015TYD470M: Inductance: Tolerance:±20% Tolerance:±20%; LCSC Part Name: 47uH ±20%; Supplier Part: C2827372; Manufacturer: SOREDE(索瑞达); Supplier Footprint: SMD,3x3mm; JLCPCB Part Class: Extended Part; Datasheet: https://atta.szlcsc.com/upload/public/pdf/source/20210518/C2827372_C6C49FAA75F56D15EE91C3C5049E1302.pdf; Supplier: LCSC; Tolerance: ±20%
U21 = TLV9061IDBVR: Number of Channels:1 Maximum Power Supply Range (Vdd-Vss):9V Rail to Rail:- Gain Bandwidth Product:- Vos - Input Offset Voltage:1.6mV Input Offset Voltage Drift(Vos TC):0.53uV/℃ Slew Rate:55V/us Ib - Input Bias Current:0.5pA Input Offset Current(Ios):- No; LCSC Part Name: 适用于成本敏感型系统的10MHz、轨到轨输入输出（RRIO）CMOS运算放大器; Supplier Part: C398358; Manufacturer: TI(德州仪器); Supplier Footprint: SOT-23-5; JLCPCB Part Class: Extended Part; Datasheet: https://www.ti.com/cn/lit/gpn/tlv9061; Supplier: LCSC; Number of Channels: 1; Maximum Power Supply Range (Vdd-Vss): 9V; Vos - Input Offset Voltage: 1.6mV; Input Offset Voltage Drift(Vos TC): 0.53uV/℃; Slew Rate: 55V/us; Ib - Input Bias Current: 0.5pA; Noise density(eN): 10nV/√Hz@1kHz; Common Mode Rejection Ratio(CMRR): 103dB; Operating Temperature: -40℃~+125℃; Single supply: 1.8V~5.5V
U39 = TLV9062IDR: Number of Channels:2 Maximum Power Supply Range (Vdd-Vss):9V Rail to Rail:- Gain Bandwidth Product:- Vos - Input Offset Voltage:1.6mV Input Offset Voltage Drift(Vos TC):0.53uV/℃ Slew Rate:6.5V/us Ib - Input Bias Current:0.5pA Input Offset Current(Ios):- N; LCSC Part Name: 适用于成本敏感型系统的10MHz、轨到轨输入输出（RRIO）CMOS运算放大器; Supplier Part: C398355; Manufacturer: TI(德州仪器); Supplier Footprint: SOIC-8; JLCPCB Part Class: Extended Part; Datasheet: https://www.ti.com/cn/lit/gpn/tlv9061; Supplier: LCSC; Number of Channels: 2; Maximum Power Supply Range (Vdd-Vss): 9V; Vos - Input Offset Voltage: 1.6mV; Input Offset Voltage Drift(Vos TC): 0.53uV/℃; Slew Rate: 6.5V/us; Ib - Input Bias Current: 0.5pA; Noise density(eN): 10nV/√Hz@1kHz; Common Mode Rejection Ratio(CMRR): 103dB; Operating Temperature: -40℃~+125℃; Single supply: 1.8V~5.5V
U40 U41 = RST10UF35V015: Capacitance:10uF Tolerance:±20% Tolerance:±20% Voltage Rating:35V Ripple Current:15mA@120Hz Equivalent Series Resistance(ESR):- Diameter:4mm Height - Seated (Max):5.4mm Lifetime:2000hrs@105℃ Operating Temperature:-40℃~+105℃ Operating Temperature:-40℃~+105; LCSC Part Name: 10uF ±20% 35V; Supplier Part: C4747970; Manufacturer: KNSCHA(科尼盛); Supplier Footprint: SMD,D4xL5.4mm; JLCPCB Part Class: Extended Part; Datasheet: https://item.szlcsc.com/datasheet/RST10UF35V015/5320097.html; Supplier: LCSC; Tolerance: ±20%; Voltage Rating: 35V; Ripple Current: 15mA@120Hz; Diameter: 4mm; Height - Seated (Max): 5.4mm; Lifetime: 2000hrs@105℃; Operating Temperature: -40℃~+105℃
U59 = DB125-3.5-4P-GN-S: Number of Positions or Pins:1x4P Pitch:3.5mm Color:Green Mounting Type:Through Hole Number of Pins:4P Number of Rows:1 Number of PINs Per Row:4 Screw Specification:M2 Current Rating:10A Voltage Rating (Max):300V Wire Gauge - AWG:16~28 Wire Gauge - AWG:16~; LCSC Part Name: 1x4P 3.5mm 直插 排数:1 每排P数:4; Supplier Part: C2757925; Manufacturer: DORABO(地博电气); Supplier Footprint: 插件,P=3.5mm; Datasheet: https://item.szlcsc.com/datasheet/DB125-3.5-4P-GN-S/2874766.html; Supplier: LCSC; Number of Positions or Pins: 1x4P; Pitch: 3.5mm; Color: Green; Mounting Type: Through Hole; Number of Pins: 4P; Number of Rows: 1; Number of PINs Per Row: 4; Screw Specification: M2; Current Rating: 10A; Voltage Rating (Max): 300V; Wire Gauge - AWG: 16~28; Wire Gauge - mm2: 1; Operating Temperature: -40℃~+105℃

## Nets
+3.3VA: C1.2 C2.2 C11.2 C12.2 C15.2 C36.2 R25.1 U21.5(V+) U39.8(VCC) U42.26(LDOIN/HPVDD) U64.2(Vout)
+3.3VD: C9.2 C10.2 C33.2 C44.2 CN1.2 R7.1 R12.1 R40.2 R44.2 R46.1 R56.1 R57.1 U1.36(3V3(OUT)) U42.6(IOVDD) U42.30(LDO_SELECT) U61.16(VDD) U62.7 U63.6(VCC)
+5VD: C42.1 D1.1(C) K1.1 L4.1 Q2.2(S) U1.39(VSYS)
AGND: C1.1 C2.1 C6.1 C8.1 C11.1 C12.1 C15.1 C17.1 C19.1 C21.2 C24.1 C29.2 C34.1 C35.1 C36.1 C46.1 C47.1 C49.1 H1.3 K1.2 R6.1 R26.1 R47.2 U21.2(V-) U39.4(VEE/GND) U42.17(AVSS) U59.2 U59.4 U64.1(GND)
DGND: C9.1 C10.1 C18.1 C33.1 C39.1 C42.2 C44.1 C52.1 CN1.1 H2.3 H3.3 Q1.2(E) R34.1 R47.1 U1.3(GND) U1.8(GND) U1.13(GND) U1.18(GND) U1.23(GND) U1.28(GND) U1.33(GND_AGND) U1.38(GND) U1.42(GND) U42.7(IOVSS) U42.12(SPI_SELECT) U42.28(DVSS) U42.33(EP) U55.4(GND) U60.8 U61.6(EN#) U61.7(VSS) U61.8(GND) U61.17(EP) U62.8 U63.5(GND)
VBAT: C39.2 Q2.3(D) U55.3(OUT)
VBUS: Q2.1(G) U1.40(VBUS)
VIN: C52.2 U55.1(IN) U60.7
ADC0: U1.31(GP26_ADC0_I2C1SDA) U61.14(D1)
ADC1: U1.32(GP27_ADC1_I2C1SCL) U61.15(D2)
ADC2: U1.34(GP28_ADC2) U61.4(D3)
BCLK: R36.1 U1.9(GP6_SPI0SCK_I2C1SDA)
BIAS: C21.1 R3.1 R5.1 R53.2 U21.1(OUT) U21.4(IN-)
BTN0: U1.16(GP12_SPI1RX_I2C0SDA_UART0TX) U60.6
BTN1: U1.17(GP13_SPI1CSn_I2C0SCL_UART0RX) U60.5
DIN: R38.1 U1.11(GP8_SPI1RX_I2C0SDA_UART1TX)
DOUT: R39.1 U1.12(GP9_SPI1CSn_I2C0SCL_UART1RX)
HPL: C54.1 U42.25(HPL)
HPR: C53.1 U42.27(HPR)
IN1M: C46.2 C48.2
IN1P: C20.2 C45.2
INST_IN: K1.4 K1.7 U59.1
INST_OUT: K1.6 U59.3
LED0: R49.2 U60.2
LED1: R48.2 U60.1
MCLK: R35.1 U1.7(GP5_SPI0CSn_I2C0SCL_UART1RX)
MICBIAS: R53.1 U42.19(MICBIAS)
MIDI_IN: R46.2 U1.2(GP1_SPI0CSn_I2C0SCL_UART0RX) U63.4(VO)
MIDI_OUT: R45.2 U1.1(GP0_SPI0RX_I2C0SDA_UART0TX)
MUX: U1.29(GP22) U61.9(SEL3) U61.10(SEL2) U61.11(SEL1)
OUT1P: C7.1 C32.1
POT0: U61.12(S1A) U62.1
POT1: U61.2(S2A) U62.2
POT2: U61.5(S3A) U62.3
POT3: U61.13(S1B) U62.4
POT4: U61.1(S2B) U62.5
POT5: U61.3(S3B) U62.6
PRE_IN: K1.3 R1.1
PRE_OUT: K1.5 U2.2
SCL0: R7.2 U1.27(GP21_I2C0SCL) U42.9(SCL/SS#)
SCL1: CN1.4 R56.2 U1.5(GP3_SPI0TX_I2C1SCL)
SDA0: R40.1 U1.26(GP20_I2C0SDA) U42.10(SDA/MOSI)
SDA1: CN1.3 R57.2 U1.4(GP2_SPI0SCK_I2C1SDA)
SW0: U1.19(GP14_SPI1SCK_I2C1SDA) U60.4
SW1: U1.20(GP15_SPI1TX_I2C1SCL) U60.3
WCLK: R37.1 U1.10(GP7_SPI0TX_I2C1SCL)
~BYPASS: R31.1 R34.2 U1.14(GP10_SPI1SCK_I2C1SDA)
~RESET: R12.2 U1.6(GP4_SPI0RX_I2C0SDA_UART1TX) U42.31(RESET#)
$1N3967: R49.1 U1.21(GP16_SPI0RX_UART0RX)
$1N3971: R48.1 U1.22(GP17_SPI0CSn_UART0TX)
$1N5594: D2.1(K) R43.2 U63.1(AN)
$1N5598: D2.2(A) H2.1 U63.2(CAT)
$1N5687: H2.2 R43.1
$1N5881: H3.2 R44.1
$1N5979: H3.1 R45.1
$1N10835: C35.2 L4.2 U64.3(Vin)
$2N3909: R35.2 U42.1(MCLK)
$2N3910: R36.2 U42.2(BCLK)
$2N3911: R37.2 U42.3(WCLK)
$2N3912: R38.2 U42.4(DIN/MFP1)
$2N3913: R39.2 U42.5(DOUT/MFP2)
$2N3920: C17.2 U42.24(AVDD)
$2N3922: C19.2 C34.2 U42.18(REF)
$2N3923: C18.2 U42.29(DVDD)
$2N3938: R11.1 U42.22(LOL)
$2N3939: C29.1 C32.2 R11.2
$2N3946: TP2.1 U42.11(MISO/MFP4)
$2N3947: TP3.1 U42.32(GPIO/MFP5)
$2N3972: TP6.1 U42.21(IN3_R)
$2N3973: TP7.1 U42.20(IN3_L)
$2N3975: TP9.1 U42.8(SCLK/MFP3)
$2N3976: C20.1 C24.2 U42.15(IN2_L)
$2N3977: C48.1 C49.2 U42.16(IN2_R)
$2N4226: TP12.1 U42.23(LOR)
$2N4249: TP11.1 U42.14(IN1_R)
$2N4315: TP10.1 U42.13(IN1_L)
$2N4806: C53.2 H1.1
$2N4810: C54.2 H1.2
$3N1576: Q1.1(B) R31.2
$3N1578: D1.2(A) K1.8 Q1.3(C)
$3N1581: U39.1(OUTA) U39.2(INA-) U40.1
$3N1582: C6.2 R2.1 U40.2
$3N1583: C5.1 R3.2 U39.3(INA+)
$3N1584: C5.2 R1.2
$3N1587: R4.1 U39.6(INB-) U39.7(OUTB)
$3N1588: R4.2 U41.1
$3N1589: C8.2 R6.2 U2.1 U41.2
$3N1590: C7.2 R5.2 U39.5(INB+)
$3N1598: R25.2 R26.2 U21.3(IN+)
$3N2358: C45.1 C47.2 R2.2

Not connected (* = marked no-connect by the designer): CN1 5* 6*; U1 15(GP11_SPI1TX_I2C1SCL)* 24(GP18_SPI0SCK_I2C1SDA)* 25(GP19_SPI0TX_I2C1SCL)* 30(RUN) 35(ADC_VREF)* 37(3V3_EN)* 41(SWDIO)* 43(SWCLK)* TP1* TP2* TP3* TP4* TP5* TP6*; U63 3(NC)*

## Notes on the sheets
sheet 1
- RING
- TIP
- SLEEVE
- TIP
- RING
- SLEEVE
